# EAGLE design ControleCarga (EAGLE 9.6.2)

## Sheet 1 of 2
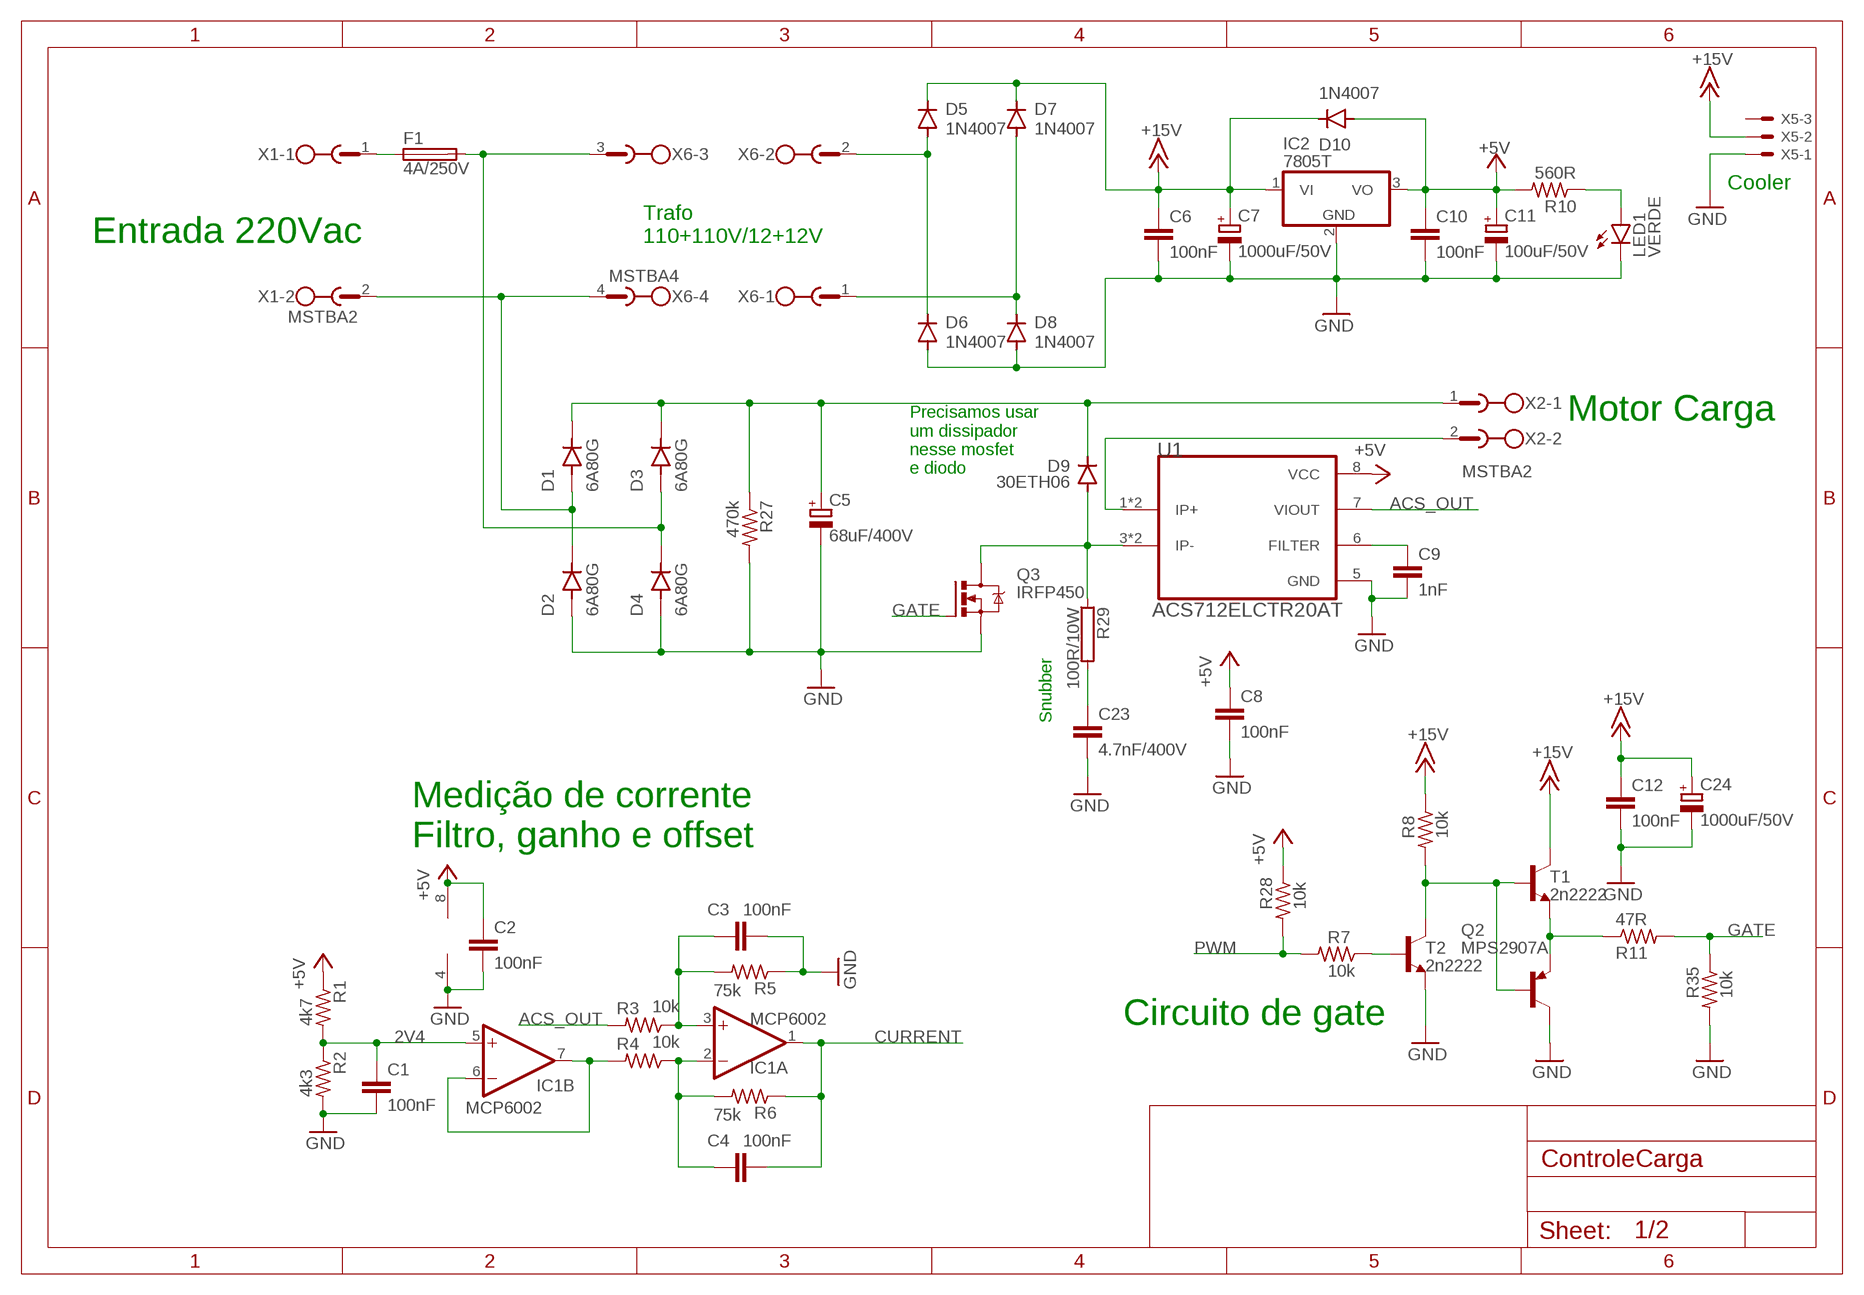
[diagram p0: schematic, sheet 1]

### Parts
C1  100nF  C-EU050-025X075  [C050-025X075]
C2  100nF  C-EU050-025X075  [C050-025X075]
C3  100nF  C-EU050-025X075  [C050-025X075]
C4  100nF  C-EU050-025X075  [C050-025X075]
C5  68uF/400V  CPOL-EUE7.5-18  [E7,5-18]
C6  100nF  C-EU050-025X075  [C050-025X075]
C7  1000uF/50V  CPOL-EUE5-13  [E5-13]
C8  100nF  C-EU050-025X075  [C050-025X075]
C9  1nF  C-EU025-024X044  [C025-024X044]
C10  100nF  C-EU050-025X075  [C050-025X075]
C11  100uF/50V  CPOL-EUE3.5-8  [E3,5-8]
C12  100nF  C-EU050-025X075  [C050-025X075]
C23  4.7nF/400V  C-EU102-043X133  [C102-043X133]
C24  1000uF/50V  CPOL-EUE5-13  [E5-13]
D1  6A80G  [DIOAD1950W125L885D700]
D2  6A80G  [DIOAD1950W125L885D700]
D3  6A80G  [DIOAD1950W125L885D700]
D4  6A80G  [DIOAD1950W125L885D700]
D5  1N4007  1N4004  [DO41-10]
D6  1N4007  1N4004  [DO41-10]
D7  1N4007  1N4004  [DO41-10]
D8  1N4007  1N4004  [DO41-10]
D9  30ETH06  BYT08P  [TO220ACS]
D10  1N4007  1N4004  [DO41-10]
F1  4A/250V  FUSESH22  [SH22]
IC1  MCP6002  MCP602SN  [SO08]
IC2  7805T  [TO220H]
LED1  VERDE  LED5MM  [LED5MM]
Q2  MPS2907A  [TO92-CBE]
Q3  IRFP450  IRFPC40  [TO247BV]
R1  4k7  R-US_0207/10  [0207/10]
R2  4k3  R-US_0207/10  [0207/10]
R3  10k  R-US_0207/10  [0207/10]
R4  10k  R-US_0207/10  [0207/10]
R5  75k  R-US_0207/10  [0207/10]
R6  75k  R-US_0207/10  [0207/10]
R7  10k  R-US_0207/10  [0207/10]
R8  10k  R-US_0207/10  [0207/10]
R10  560R  R-US_0207/10  [0207/10]
R11  47R  R-US_0207/10  [0207/10]
R27  470k  R-US_0207/10  [0207/10]
R28  10k  R-US_0207/10  [0207/10]
R29  100R/10W  RKH216-8  [KH216-8]
R35  10k  R-US_0207/10  [0207/10]
T1  2n2222  2N2222-NPN-TO92-EBC  [TO92-EBC]
T2  2n2222  2N2222-NPN-TO92-EBC  [TO92-EBC]
U1  ACS712ELCTR20AT  ACS712ELCTR30AT  [SOIC127P600X175-8N]
X1  MSTBA2  [MSTBA2]
X2  MSTBA2  [MSTBA2]
X5  KK-156-3  [KK-156-3]
X6  MSTBA4  [MSTBA4]

### Nets
2V4: C1.1 IC1.5(B:+IN) R1.2 R2.1
+5V: C2.1 C8.1 C10.1 C11.+ D10.A IC1.8(P:V+) IC2.3(VO) R1.1 R10.2 R28.1 U1.8(VCC) ; also sheet 2
+15V: C6.1 C7.+ C12.1 C24.+ D5.C D7.C D10.C IC2.1(VI) R8.1 T1.C X5.2
ACS_OUT: R3.2 U1.7(VIOUT)
CURRENT: C4.2 IC1.1(A:OUT) R6.1 ; also sheet 2
GATE: Q3.G R11.2 R35.1
GND: C1.2 C2.2 C3.2 C5.- C6.2 C7.- C8.2 C9.2 C10.2 C11.- C12.2 C23.2 C24.- D2.A D4.A D6.A D8.A IC1.4(P:V-) IC2.2(GND) LED1.K(C) Q2.C Q3.S R2.2 R5.1 R27.2 R35.2 T2.E U1.5(GND) X5.1 ; also sheet 2
N$9: D7.A D8.C X6.1
N$11: C23.1 R29.2
N$18: Q2.E R11.1 T1.E
N$19: LED1.A R10.1
N$22: D3.A D4.C(K) F1.2 X6.3
N$33: D1.A D2.C(K) X1.2 X6.4
N$34: U1.1(IP+) U1.2(IP+) X2.2
N$35: D9.A Q3.D R29.1 U1.3(IP-) U1.4(IP-)
N$37: C5.+ D1.C(K) D3.C(K) D9.C R27.1 X2.1
N$38: C9.1 U1.6(FILTER)
N$39: IC1.6(B:-IN) IC1.7(B:OUT) R4.2
N$40: C4.1 IC1.2(A:-IN) R4.1 R6.2
N$41: C3.1 IC1.3(A:+IN) R3.1 R5.2
N$42: F1.1 X1.1
N$45: R7.1 T2.B
N$46: D5.A D6.C X6.2
N$53: Q2.B R8.2 T1.B T2.C
PWM: R7.2 R28.2 ; also sheet 2
Unconnected: X5.3

### Notes on the sheet
- Cooler
- Entrada 220Vac
- Trafo
  110+110V/12+12V
- Motor Carga
- Precisamos usar
  um dissipador
  nesse mosfet
  e diodo
- Snubber
- Medição de corrente
  Filtro, ganho e offset
- Circuito de gate

## Sheet 2 of 2
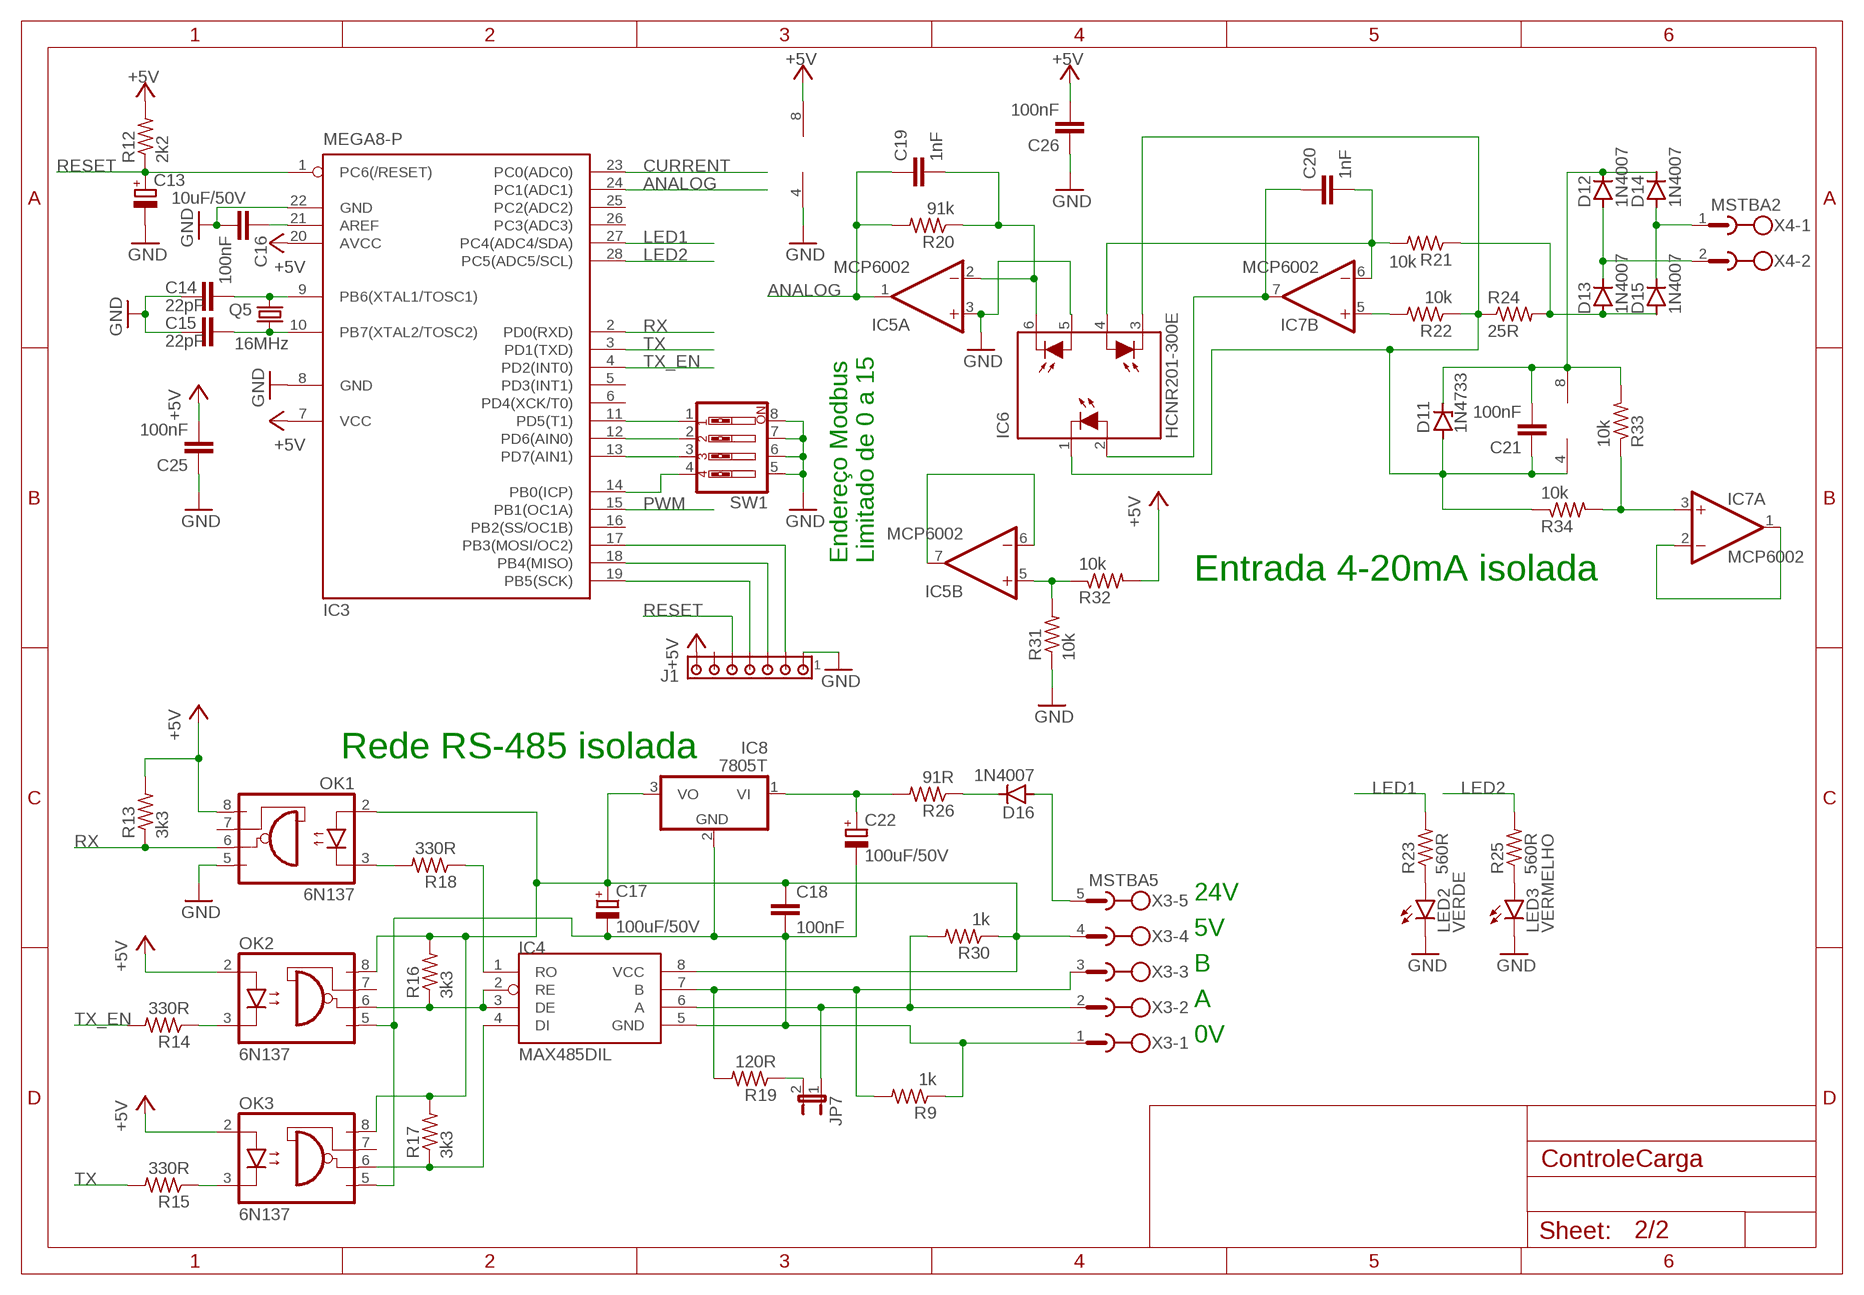
[diagram p1: schematic, sheet 2]

### Parts
C13  10uF/50V  CPOL-EUE2-5  [E2-5]
C14  22pF  C-EU025-024X044  [C025-024X044]
C15  22pF  C-EU025-024X044  [C025-024X044]
C16  100nF  C-EU050-025X075  [C050-025X075]
C17  100uF/50V  CPOL-EUE3.5-8  [E3,5-8]
C18  100nF  C-EU050-025X075  [C050-025X075]
C19  1nF  C-EU025-024X044  [C025-024X044]
C20  1nF  C-EU025-024X044  [C025-024X044]
C21  100nF  C-EU050-025X075  [C050-025X075]
C22  100uF/50V  CPOL-EUE3.5-8  [E3,5-8]
C25  100nF  C-EU050-025X075  [C050-025X075]
C26  100nF  C-EU050-025X075  [C050-025X075]
D11  1N4733  1N4728  [DO41Z10]
D12  1N4007  1N4004  [DO41-10]
D13  1N4007  1N4004  [DO41-10]
D14  1N4007  1N4004  [DO41-10]
D15  1N4007  1N4004  [DO41-10]
D16  1N4007  1N4004  [DO41-10]
IC3  MEGA8-P  [DIL28-3]
IC4  MAX485DIL  [DIL08]
IC5  MCP6002  MCP602SN  [SO08]
IC6  HCNR201-300E  [DIP8-400]
IC7  MCP6002  MCP602SN  [SO08]
IC8  7805T  [TO220H]
J1  MTA07-100  [10X07MTA]
JP7  JP1E  [JP1]
LED2  VERDE  LED5MM  [LED5MM]
LED3  VERMELHO  LED5MM  [LED5MM]
OK1  6N137  [DIL08]
OK2  6N137  [DIL08]
OK3  6N137  [DIL08]
Q5  16MHz  CRYSTALHC49S  [HC49/S]
R9  1k  R-US_0207/10  [0207/10]
R12  2k2  R-US_0207/10  [0207/10]
R13  3k3  R-US_0207/10  [0207/10]
R14  330R  R-US_0207/10  [0207/10]
R15  330R  R-US_0207/10  [0207/10]
R16  3k3  R-US_0207/10  [0207/10]
R17  3k3  R-US_0207/10  [0207/10]
R18  330R  R-US_0207/10  [0207/10]
R19  120R  R-US_0207/10  [0207/10]
R20  91k  R-US_0207/10  [0207/10]
R21  10k  R-US_0207/10  [0207/10]
R22  10k  R-US_0207/10  [0207/10]
R23  560R  R-US_0207/10  [0207/10]
R24  25R  R-US_0207/10  [0207/10]
R25  560R  R-US_0207/10  [0207/10]
R26  91R  R-US_0207/10  [0207/10]
R30  1k  R-US_0207/10  [0207/10]
R31  10k  R-US_0207/10  [0207/10]
R32  10k  R-US_0207/10  [0207/10]
R33  10k  R-US_0207/10  [0207/10]
R34  10k  R-US_0207/10  [0207/10]
SW1  SW_DIP-4  [EDG-04]
X3  MSTBA5  [MSTBA5]
X4  MSTBA2  [MSTBA2]

### Nets
0V: C17.- C18.2 C22.- IC4.5(GND) IC8.2(GND) OK2.5(GND) OK3.5(GND) R9.1 X3.1
+5V: C25.2 C26.2 IC3.7(VCC) IC3.20(AVCC) IC5.8(P:V+) J1.7 OK1.8(VCC) OK2.2(A) OK3.2(A) R12.2 R13.2 R32.2 ; also sheet 1
ANALOG: C19.1 IC3.24(PC1(ADC1)) IC5.1(A:OUT) R20.2
CURRENT: IC3.23(PC0(ADC0)) ; also sheet 1
GND: C13.- C14.2 C15.2 C16.2 C25.1 C26.1 IC3.8(GND) IC3.22(GND) IC5.3(A:+IN) IC5.4(P:V-) IC6.5(A2) J1.1 LED2.K(C) LED3.K(C) OK1.5(GND) R31.1 SW1.5 SW1.6 SW1.7 SW1.8 ; also sheet 1
GNDISO: C21.1 D11.A IC6.1(C) IC6.3(C1) IC7.4(P:V-) R22.1 R24.1 R34.1
LED1: IC3.27(PC4(ADC4/SDA)) R23.2
LED2: IC3.28(PC5(ADC5/SCL)) R25.2
N$1: C16.1 IC3.21(AREF)
N$2: IC4.2(RE) IC4.3(DE) OK2.6(VO) R16.1
N$3: D14.A D15.C X4.1
N$4: LED2.A R23.1
N$5: IC3.14(PB0(ICP)) SW1.4
N$6: IC3.13(PD7(AIN1)) SW1.3
N$7: IC3.12(PD6(AIN0)) SW1.2
N$8: IC3.11(PD5(T1)) SW1.1
N$10: LED3.A R25.1
N$12: C21.2 D11.C D12.C D14.C IC7.8(P:V+) R33.2
N$13: IC4.7(B) R9.2 R19.2 X3.3
N$14: IC4.6(A) JP7.1 R30.2 X3.2
N$15: IC4.4(DI) OK3.6(VO) R17.1
N$16: OK1.3(C) R18.2
N$17: IC4.1(RO) R18.1
N$20: OK2.3(C) R14.1
N$21: OK3.3(C) R15.1
N$23: IC3.19(PB5(SCK)) J1.4
N$24: JP7.2 R19.1
N$25: C19.2 IC5.2(A:-IN) IC6.6(C2) R20.1
N$26: C22.+ IC8.1(VI) R26.2
N$27: IC5.6(B:-IN) IC5.7(B:OUT)
N$28: IC7.1(A:OUT) IC7.2(A:-IN)
N$29: C20.1 IC6.2(A) IC7.7(B:OUT)
N$30: IC7.5(B:+IN) R22.2
N$31: D13.A D15.A R21.1 R24.2
N$32: C20.2 IC6.4(A1) IC7.6(B:-IN) R21.2
N$36: IC3.18(PB4(MISO)) J1.3
N$43: C17.+ C18.1 IC4.8(VCC) IC8.3(VO) OK1.2(A) OK2.8(VCC) OK3.8(VCC) R16.2 R17.2 R30.1 X3.4
N$44: IC3.17(PB3(MOSI/OC2)) J1.2
N$47: D16.A X3.5
N$48: D12.A D13.C X4.2
N$49: C14.1 IC3.9(PB6(XTAL1/TOSC1)) Q5.2
N$50: C15.1 IC3.10(PB7(XTAL2/TOSC2)) Q5.1
N$51: D16.C R26.1
N$52: IC5.5(B:+IN) R31.2 R32.1
N$54: IC7.3(A:+IN) R33.1 R34.2
PWM: IC3.15(PB1(OC1A)) ; also sheet 1
RESET: C13.+ IC3.1(PC6(/RESET)) J1.5 R12.1
RX: IC3.2(PD0(RXD)) OK1.6(VO) R13.1
TX: IC3.3(PD1(TXD)) R15.2
TX_EN: IC3.4(PD2(INT0)) R14.2
Unconnected: IC3.5(PD3(INT1)) IC3.6(PD4(XCK/T0)) IC3.16(PB2(SS/OC1B)) IC3.25(PC2(ADC2)) IC3.26(PC3(ADC3)) J1.6 OK1.7(VE) OK2.7(VE) OK3.7(VE)

### Notes on the sheet
- Endereço Modbus
  Limitado de 0 a 15
- Entrada 4-20mA isolada
- Rede RS-485 isolada
- 24V
- 5V
- B
- A
- 0V

## Library data of the parts
C1-C4 C6 C8-C10 C12 C14-C16 C18-C21 C23 C25 C26 = rcl:C-EU: CAPACITOR, European symbol; SPICEPREFIX: C
C5 C7 C11 C13 C17 C22 C24 = rcl:CPOL-EU: POLARIZED CAPACITOR, European symbol; SPICEPREFIX: C
D1-D4 = 6A80G:6A80G: Check availability <https://pricing.snapeda.com/parts/6A80G/Taiwan%20Semiconductor/view-part?ref=eda>; AVAILABILITY: In Stock; DESCRIPTION: 6A, 800V, Standard Recovery Rectifier; MF: Taiwan Semiconductor; MP: 6A80G; PACKAGE: R-6 Taiwan Semiconductor; PRICE: None; PURCHASE-URL: https://pricing.snapeda.com/search/part/6A80G/?ref=eda
D5-D8 D10 D12-D16 = diode:1N4004: DIODE general purpose rectifier, 1 A
D9 = diode:BYT08P: DIODE ultra fast
D11 = diode:1N4728: Z DIODE 3.3 V, 1W, 5 percent
F1 = fuse:FUSE: Fuse; OC_FARNELL: unknown; OC_NEWARK: unknown
IC1 IC5 IC7 = linear:MCP602: Single Op Amp 2.7V to 6.0V Single Supply CMOS Source: http://ww1.microchip.com/downloads/en/DeviceDoc/21314g.pdf
IC2 IC8 = linear:78*: Positive VOLTAGE REGULATOR Source: http://cache.national.com/ds/LM/LM78L05.pdf http://www.fairchildsemi.com/ds/LM/LM7805.pdf
IC3 = atmel:MEGA8-P: MICROCONTROLLER 8 Kbytes FLASH, 1 kbytes SRAM, 512 bytes EEPROM, USART, 4-channel 10 bit ADC, 2-channel 8 bit ADC Pin compatible with Atmega48, ATMega88, ATMega168 Source: avr.lbr; OC_FARNELL: unknown; OC_NEWARK: unknown
IC4 = MAX485:MAX485; DESCRIPTION: 1/1 Transceiver Half RS422, RS485 8-uMAX-EP|8-uSOP-EP; MF: Maxim Integrated; MP: MAX485; PACKAGE: None; PURCHASE-URL: https://pricing.snapeda.com/search/part/MAX485/?ref=eda
IC6 = avago:HCNR20*: High-Linearity Analog Optocouplers Source: AV02-0886EN+DS+HCNR200+10Dec2011.pdf
J1 = con-amp:MTA07-100: AMP connector
JP7 = jumper:JP1E: JUMPER
LED1-LED3 = led:LED: LED OSRAM: - CHIPLED LG R971, LG N971, LY N971, LG Q971, LY Q971, LO R971, LY R971 LH N974, LH R974 LS Q976, LO Q976, LY Q976 LO Q996 - Hyper CHIPLED LW Q18S LB Q993, LB Q99A, LB R99A - SideLED LS A670, LO A670, LY A670, LG A670, LP A670 LB A673, LV A673, LT A673, LW A673 LH A674 LY A675 LS A676, LA A676, LO A676, LY A676, LW A676 LS A679, LY A679, LG A679 - Hyper Micro SIDELED® LS Y876, LA Y876, LO Y876, LY Y876 LT Y87S - SmartLED LW L88C, LW L88S LB L89C, LB L89S, LG L890 LS L89K, LO L89K, LY L89K LS L896, LA L896, LO L896, LY L896 - TOPLED LS T670, LO T670, LY T670, LG T670, LP T670 LSG T670, LSP T670, LSY T670, LOP T670, LYG T670 LG T671, LOG T671, LSG T671 LB T673, LV T673, LT T673, LW T673 LH T674 LS T676, LA T676, LO T676, LY T676, LB T676, LH T676, LSB T676, LW T676 LB T67C, LV T67C, LT T67C, LS T67K, LO T67K, LY T67K, LW E67C LS E67B, LA E67B, LO E67B, LY E67B, LB E67C, LV E67C, LT E67C LW T67C LS T679, LY T679, LG T679 LS T770, LO T770, LY T770, LG T770, LP T770 LB T773, LV T773, LT T773, LW T773 LH T774 LS E675, LA E675, LY E675, LS T675 LS T776, LA T776, LO T776, LY T776, LB T776 LHGB T686 LT T68C, LB T68C - Hyper Mini TOPLED® LB M676 - Mini TOPLED Santana® LG M470 LS M47K, LO M47K, LY M47K Source: http://www.osram.convergy.de LUXEON: - LUMILED® LXK2-PW12-R00, LXK2-PW12-S00, LXK2-PW14-U00, LXK2-PW14-V00 LXK2-PM12-R00, LXK2-PM12-S00, LXK2-PM14-U00 LXK2-PE12-Q00, LXK2-PE12-R00, LXK2-PE12-S00, LXK2-PE14-T00, LXK2-PE14-U00 LXK2-PB12-K00, LXK2-PB12-L00, LXK2-PB12-M00, LXK2-PB14-N00, LXK2-PB14-P00, LXK2-PB14-Q00 LXK2-PR12-L00, LXK2-PR12-M00, LXK2-PR14-Q00, LXK2-PR14-R00 LXK2-PD12-Q00, LXK2-PD12-R00, LXK2-PD12-S00 LXK2-PH12-R00, LXK2-PH12-S00 LXK2-PL12-P00, LXK2-PL12-Q00, LXK2-PL12-R00 Source: www.luxeon.com KINGBRIGHT: KA-3528ASYC Source: www.kingbright.com
OK1-OK3 = optocoupler:6N137: MOTOROLA OPTO COUPLER; MPN: 6N137; OC_FARNELL: 1328376; OC_NEWARK: 52M1895
Q2 = transistor-pnp:MPS2907*: PNP Transistror
Q3 = transistor-power:IRFPC40: N-CHANNEL MOS FET
Q5 = crystal:CRYSTAL: CRYSTAL; OC_FARNELL: 1667008; OC_NEWARK: unknown
R1-R28 R30-R35 = rcl:R-US_: RESISTOR, American symbol; SPICEPREFIX: R
R29 = resistor-power:R: Power Resitor; OC_FARNELL: unknown; OC_NEWARK: unknown
SW1 = special:SW_DIP-4: DIP SWITCH
T1 T2 = transistor-neu-to92:*-NPN-: NPN Transistror
U1 = ACS712ELCTR30AT:ACS712ELCTR30AT: Sensor: current; Package: SO8; Usup: 4.5÷5.5VDC; Iin: ± 30A; 66mV Check availability <https://pricing.snapeda.com/parts/ACS712ELCTR-30A-T/Allegro/view-part?ref=eda>; AVAILABILITY: In Stock; DESCRIPTION: Current Sensor 30A 1 Channel Hall Effect, Open Loop Bidirectional 8-SOIC (0.154, 3.90mm Width); MF: Allegro; MP: ACS712ELCTR-30A-T; PACKAGE: SOIC-8 Allegro MicroSystems LLC; PRICE: None; PURCHASE-URL: https://pricing.snapeda.com/search/part/ACS712ELCTR-30A-T/?ref=eda
X1 X2 X4 = con-phoenix-508:MSTBA2: PHOENIX; MF: FARNELL; MPN: 1757242; OC_FARNELL: 3705171; OC_NEWARK: 71C4161
X3 = con-phoenix-508:MSTBA5: PHOENIX; MPN: 1757271; OC_FARNELL: 3705201; OC_NEWARK: 71C4164
X5 = con-molex:KK-156-3: KK 156 HEADER Source: http://www.molex.com/pdm_docs/sd/026604100_sd.pdf; MF: MOLEX; OC_FARNELL: unknown; OC_NEWARK: unknown
X6 = con-phoenix-508:MSTBA4: PHOENIX; MF: FARNELL; MPN: 1757268; OC_FARNELL: 3705195; OC_NEWARK: 71C4163

## Board
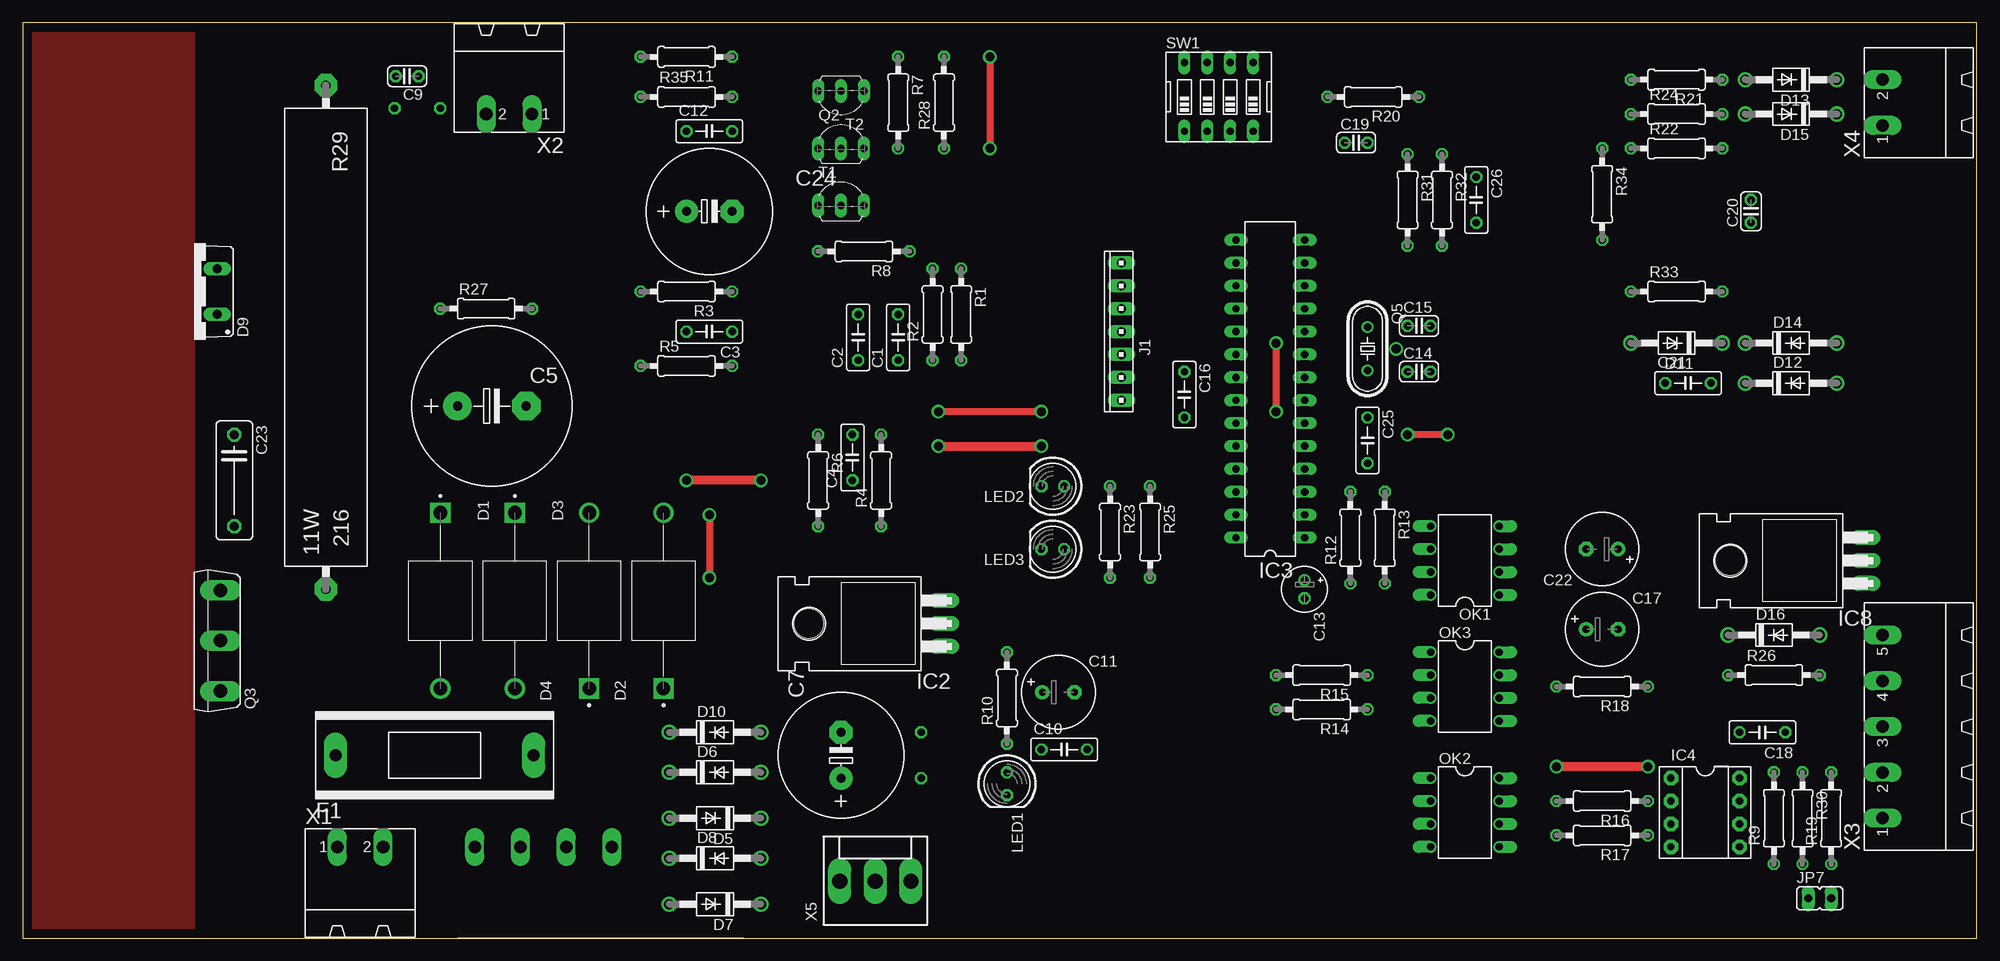
[diagram p2: board, top side]
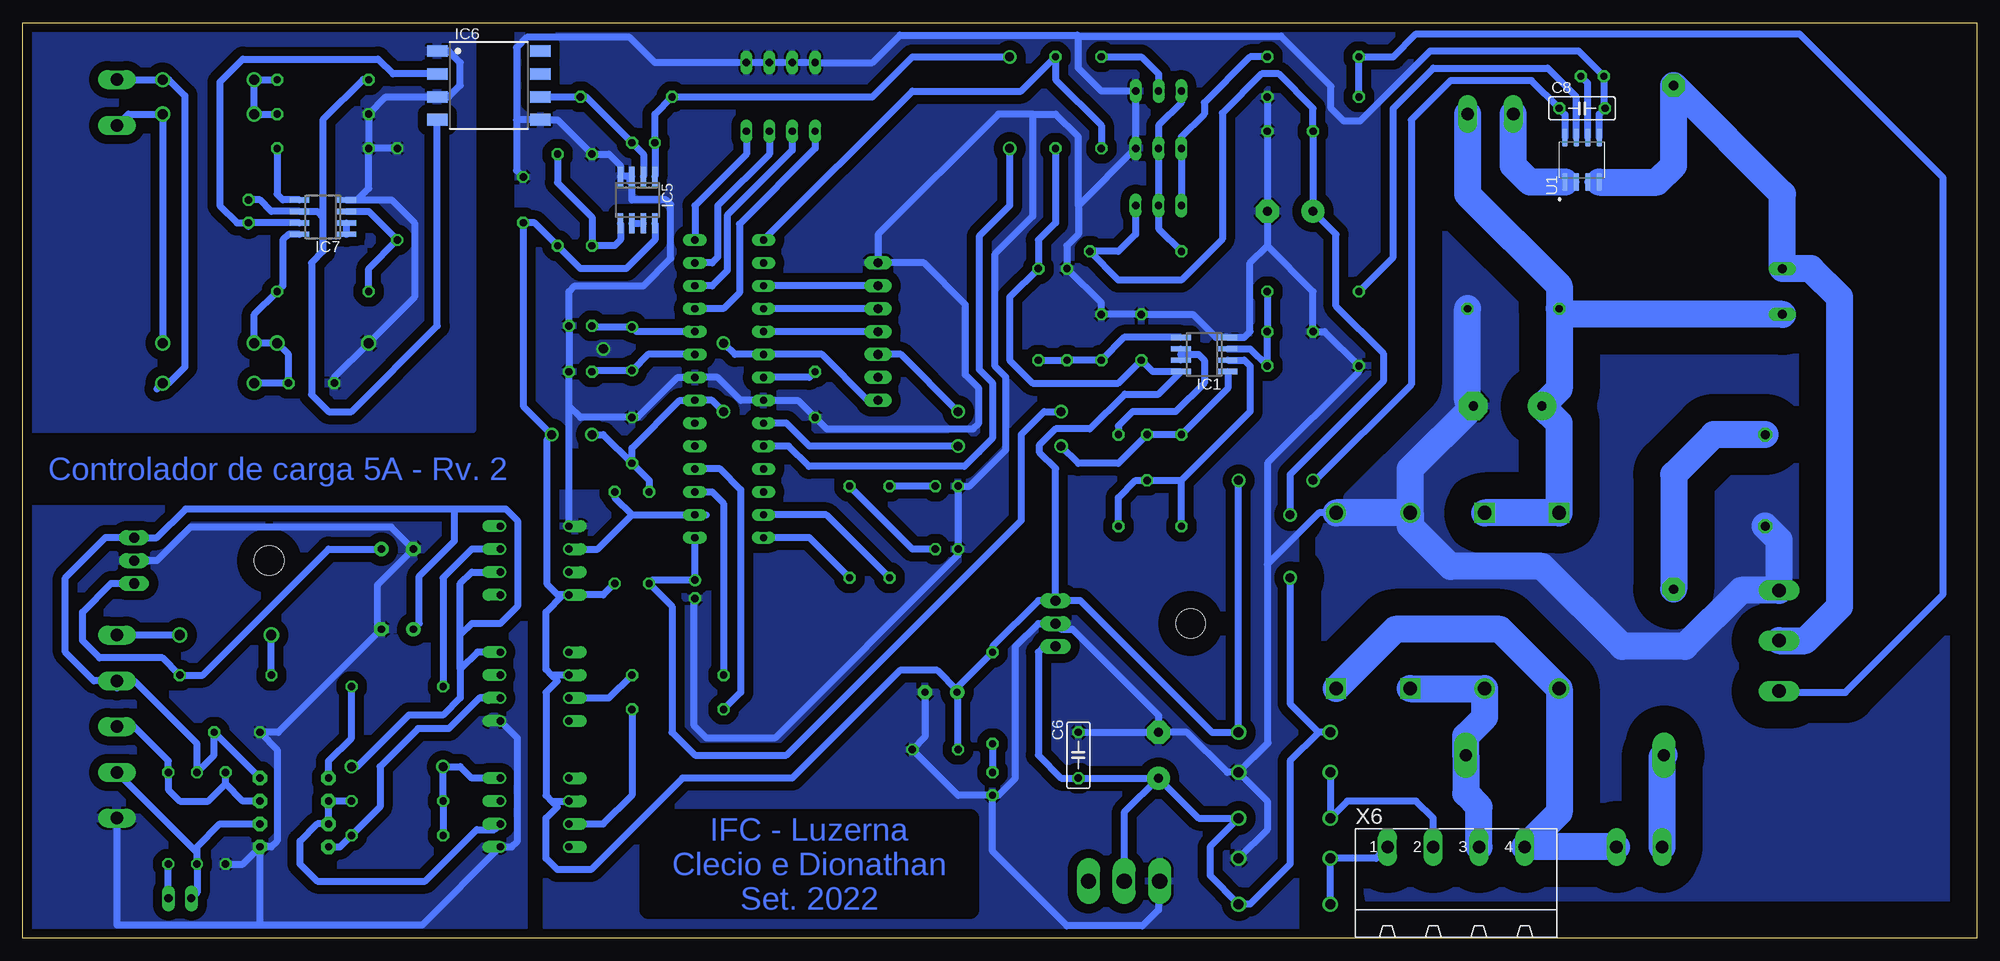
[diagram p3: board, bottom side, seen from below]

Size 216.84 x 101.59 mm. Coordinates in mm from the lower left corner, seen from the top.
Outline: 0,0 216.84,0 216.84,101.59 0,101.59 0,0
Copper layers (1*16): Top 0.035mm / dielectric 1.5mm / Bottom 0.035mm
Design rules "default *": minimum track width 0.75mm, minimum drill 0.5mm, track to track 0.75mm, track to pad 0.5mm, pad to pad 0.5mm, via to via 0.5mm, smd to smd 0.3mm, copper to edge 40mil, drill to drill 6mil, minimum pad ring 10mil, minimum via ring 8mil, stop-mask expansion 4mil, vias tented up to drill 0mil, thermal gap 10mil

### Footprints (pad centres in the part's own frame; a part is rotated, then mirrored left to right if it is on the bottom)
C050-025X075 = drill 0.813 octagon: 1 -2.54,0; 2 2.54,0
E7,5-18 = drill 1.016 pad 3.15: + -3.81,0 | drill 1.016 pad 3.15 octagon: - 3.81,0
E5-13 = drill 1.016 pad 2.54: + -2.54,0 | drill 1.016 pad 2.54 octagon: - 2.54,0
C025-024X044 = drill 0.813 octagon: 1 -1.27,0; 2 1.27,0
E3,5-8 = drill 0.813 pad 1.6: + -1.778,0 | drill 0.813 pad 1.6 octagon: - 1.778,0
E2-5 = drill 0.813 pad 1.27: + -1.016,0 | drill 0.813 pad 1.27 octagon: - 1.016,0
C102-043X133 = drill 1.016 octagon: 1 -5.08,0; 2 5.08,0
DIOAD1950W125L885D700 = drill 1.5: A 9.75,0 | drill 1.5 square: C -9.75,0
DO41-10 = drill 1.118: A 5.08,0; C -5.08,0
TO220ACS = drill 1.016 long: A 2.54,-2.54; C -2.54,-2.54
DO41Z10 = drill 1.118: A 5.08,0; C -5.08,0
SH22 = drill 1.321 pad 2.54 long: 1 -10.998,0; 2 10.998,0
SO08 = smd 0.6 x 2.2: 1 -1.905,-2.6; 2 -0.635,-2.6; 3 0.635,-2.6; 4 1.905,-2.6; 5 1.905,2.6; 6 0.635,2.6; 7 -0.635,2.6; 8 -1.905,2.6
TO220H = drill 1.118 long: 1 -2.54,-10.16; 2 0,-10.16; 3 2.54,-10.16 | hole 3.302: 0,4.826
DIL28-3 = drill 0.813 long: 1 -16.51,-3.81; 2 -13.97,-3.81; 3 -11.43,-3.81; 4 -8.89,-3.81; 5 -6.35,-3.81; 6 -3.81,-3.81; 7 -1.27,-3.81; 8 1.27,-3.81; 9 3.81,-3.81; 10 6.35,-3.81; 11 8.89,-3.81; 12 11.43,-3.81; 13 13.97,-3.81; 14 16.51,-3.81; 15 16.51,3.81; 16 13.97,3.81; 17 11.43,3.81; 18 8.89,3.81; 19 6.35,3.81; 20 3.81,3.81; 21 1.27,3.81; 22 -1.27,3.81; 23 -3.81,3.81; 24 -6.35,3.81; 25 -8.89,3.81; 26 -11.43,3.81; 27 -13.97,3.81; 28 -16.51,3.81
DIL08 = drill 0.813 pad 1.6 octagon: 1 -3.81,-3.81; 2 -1.27,-3.81; 3 1.27,-3.81; 4 3.81,-3.81; 5 3.81,3.81; 6 1.27,3.81; 7 -1.27,3.81; 8 -3.81,3.81
DIP8-400 = smd 1.3 x 2.29: 1 -3.81,-5.72; 2 -1.27,-5.72; 3 1.27,-5.72; 4 3.81,-5.72; 5 3.81,5.72; 6 1.27,5.72; 7 -1.27,5.72; 8 -3.81,5.72
10X07MTA = drill 1.016 long: 1 7.62,0; 2 5.08,0; 3 2.54,0; 4 0,0; 5 -2.54,0; 6 -5.08,0; 7 -7.62,0
JP1 = drill 0.914 long: 1 0,-1.27; 2 0,1.27
LED5MM = drill 0.813 octagon: A -1.27,0; K 1.27,0
DIL08' = drill 0.813 offset: 1 -3.81,-3.81; 2 -1.27,-3.81; 3 1.27,-3.81; 4 3.81,-3.81; 5 3.81,3.81; 6 1.27,3.81; 7 -1.27,3.81; 8 -3.81,3.81
TO92-CBE = drill 0.813 long: B 0,0; C 2.54,0; E -2.54,0
TO247BV = drill 1.499 long: D 0,-2.921; G -5.588,-2.921; S 5.588,-2.921
HC49/S = drill 0.813: 1 -2.413,0; 2 2.413,0
0207/10 = drill 0.813 octagon: 1 -5.08,0; 2 5.08,0
KH216-8 = drill 1.016 pad 2.54 octagon: 1 -27.94,0; 2 27.94,0
EDG-04 = drill 0.813 long: 1 -3.81,-3.81; 2 -1.27,-3.81; 3 1.27,-3.81; 4 3.81,-3.81; 5 3.81,3.81; 6 1.27,3.81; 7 -1.27,3.81; 8 -3.81,3.81
TO92-EBC = drill 0.813 long: B 0,-1.27; C 2.54,-1.27; E -2.54,-1.27
SOIC127P600X175-8N = smd 1.97 x 0.6: 1 -2.475,1.905; 2 -2.475,0.635; 3 -2.475,-0.635; 4 -2.475,-1.905; 5 2.475,-1.905; 6 2.475,-0.635; 7 2.475,0.635; 8 2.475,1.905
MSTBA2 = drill 1.397 long: 1 -2.54,5.08; 2 2.54,5.08
MSTBA5 = drill 1.397 long: 1 -10.16,5.08; 2 -5.08,5.08; 3 0,5.08; 4 5.08,5.08; 5 10.16,5.08
KK-156-3 = drill 1.7 pad 2.184 long: 1 -3.96,0; 2 0,0; 3 3.96,0
MSTBA4 = drill 1.397 long: 1 -7.62,5.08; 2 -2.54,5.08; 3 2.54,5.08; 4 7.62,5.08

### Placement (x,y rotation side)
C1  97.16,66.67 90 top
C2  92.71,66.67 90 top
C3  76.2,67.31 180 top
C4  92.08,53.34 90 top
C5  52.07,59.05 0 top
C6  99.69,20.32 90 bottom
C7  90.81,20.32 90 top
C8  43.81,92.08 0 bottom
C9  42.67,95.63 180 top
C10  115.57,20.95 0 top
C11  114.94,27.3 0 top
C12  76.2,89.53 0 top
C13  142.24,38.73 270 top
C14  154.94,62.87 0 top
C15  154.94,67.94 0 top
C16  128.91,60.33 270 top
C17  175.26,34.29 0 top
C18  193.04,22.86 180 top
C19  147.96,88.27 0 top
C20  191.77,80.64 90 top
C21  184.78,61.59 0 top
C22  175.26,43.18 180 top
C23  23.5,50.8 270 top
C24  76.2,80.64 0 top
C25  149.22,55.24 270 top
C26  161.29,81.92 270 top
D1  46.35,37.47 270 top
D2  71.12,37.47 90 top
D3  54.61,37.47 270 top
D4  62.87,37.47 90 top
D5  76.83,13.34 180 top
D6  76.83,18.41 0 top
D7  76.83,3.81 180 top
D8  76.83,8.89 0 top
D9  19.05,71.75 90 top
D10  76.83,22.86 0 top
D11  183.51,66.04 180 top
D12  196.22,61.59 0 top
D13  196.22,95.25 180 top
D14  196.22,66.04 0 top
D15  196.22,91.44 180 top
D16  194.31,33.66 0 top
F1  45.72,20.32 0 top
IC1  85.72,64.77 90 bottom
IC2  92.08,34.92 90 top
IC3  138.43,60.96 90 top
IC4  186.69,13.97 270 top
IC5  148.59,81.92 180 bottom
IC6  165.1,94.61 270 bottom
IC7  183.51,80.01 90 bottom
IC8  194.31,41.91 90 top
J1  121.92,67.31 90 top
JP7  199.39,4.45 270 top
LED1  109.22,17.14 270 top
LED2  114.3,50.16 180 top
LED3  114.3,43.18 180 top
OK1  6N137  [DIL08']  160.02,41.91 90 top
OK2  6N137  [DIL08']  160.02,13.97 270 top
OK3  6N137  [DIL08']  160.02,27.94 270 top
Q2  90.81,87.63 0 top
Q3  19.05,33.02 90 top
Q5  149.22,65.41 270 top
R1  104.14,69.22 270 top
R2  100.97,69.22 90 top
R3  73.66,71.75 180 top
R4  95.25,50.8 90 top
R5  73.66,63.5 0 top
R6  88.27,50.8 270 top
R7  97.16,92.71 270 top
R8  93.34,76.2 180 top
R9  194.31,13.34 90 top
R10  109.22,26.67 90 top
R11  73.66,97.79 180 top
R12  147.32,44.45 90 top
R13  151.13,44.45 270 top
R14  144.15,25.4 180 top
R15  144.15,29.21 180 top
R16  175.26,15.24 180 top
R17  175.26,11.43 180 top
R18  175.26,27.94 180 top
R19  200.66,13.34 90 top
R20  149.86,93.34 180 top
R21  183.51,95.25 180 top
R22  183.51,87.63 0 top
R23  120.65,45.09 270 top
R24  183.51,91.44 0 top
R25  125.09,45.09 270 top
R26  194.31,29.21 0 top
R27  51.44,69.85 0 top
R28  102.23,92.71 90 top
R29  33.66,66.67 270 top
R30  197.49,13.34 270 top
R31  153.67,81.92 270 top
R32  157.48,81.92 270 top
R33  183.51,71.75 0 top
R34  175.26,82.55 270 top
R35  73.66,93.34 0 top
SW1  132.72,93.34 0 top
T1  90.81,82.55 0 top
T2  90.81,92.71 180 top
U1  43.81,86.36 90 bottom
X1  37.47,5.08 0 top
X2  53.98,96.52 180 top
X3  211.46,23.5 90 top
X4  211.46,92.71 90 top
X5  94.61,6.35 0 top
X6  57.78,5.08 0 bottom

### Tracks (layer width: path | path; a pad name or v marks a point on that pad's centre or on a via)
0V
  Bottom 0.75: X3.1 206.38,1.52 190.25,1.52 | 190.25,1.52 190.5,1.76 IC4.5 | IC4.5 189.23,10.16 188.59,10.79 188.59,20.95 C18.2 188.47,22.86 C17.- 177.48,34.2 177.48,39.18 C22.- 175.93,45.62 198.22,45.62 201.93,41.91 IC8.2 | 190.25,1.52 172.47,1.52 OK2.5 162.56,10.16 161.93,10.79 161.93,22.23 OK3.5 | R9.1 192.41,8.26 IC4.5
  pour Bottom (isolate 1.016): 161.29,47.62 161.29,1.27 215.9,1.27 215.9,47.62
2V4
  Bottom 0.75: R1.2 R2.1 C1.1 94.61,66.67 IC1.5
+5V  (via drill 1)
  Top 0.75: v158.12,55.88 v153.67,55.88 | v139.06,66.04 v139.06,58.42
  Top 1: v81.92,50.8 v73.66,50.8
  Bottom 0.75: U1.8 45.72,91.38 46.35,92.01 C8.1 49.44,95.16 58.42,95.16 62.77,90.81 62.77,61.42 73.39,50.8 v73.66,50.8 | v81.92,50.8 D10.A 84.87,22.86 99.51,37.49 102.21,37.49 IC2.3 | R28.1 102.23,79.38 104.14,77.47 R1.1 107.31,71.12 107.31,64.14 104.78,61.59 95.25,61.59 C2.1 91.44,62.87 IC1.8 90.81,60.38 94.56,60.38 98.42,56.52 102.23,56.52 103.98,54.77 103.98,53.88 102.2,52.1 102.23,52.07 IC2.3 | IC2.3 104.14,37.47 109.22,32.38 R10.2 113.16,27.81 C11.+ | C25.2 149.22,54.39 143.93,59.69 IC3.7 140.34,59.69 v139.06,58.42 | J1.7 121.94,59.71 123.07,59.71 128.13,64.77 IC3.20 137.79,64.77 v139.06,66.04 | R12.2 147.32,50.8 C25.2 | IC5.8 146.69,77.47 149.86,74.3 154.94,74.3 R32.2 160.02,79.38 C26.2 161.29,59.05 v158.12,55.88 158.63,55.37 158.63,39.27 157.46,38.1 OK1.8 | v153.67,55.88 152.4,55.88 C25.2 | 158.12,15.24 158.75,15.88 158.75,27.3 157.48,28.57 158.12,29.21 | 158.12,15.24 157.48,14.61 158.75,13.34 158.75,8.89 157.48,7.62 153.78,7.62 143.62,17.78 131.44,17.78 119.5,29.72 115.34,29.72 113.16,27.54 C11.+ | 158.12,15.24 OK2.2 | OK3.2 158.12,29.21 | 158.12,29.21 158.75,29.84 158.75,36.2 156.84,38.1 OK1.8 | R13.2 152.4,38.1 OK1.8 | C10.1 113.03,27.18 C11.+
+15V  (via drill 1)
  Top 0.75: v76.2,46.99 v76.2,40.01
  Bottom 0.75: C7.+ C6.1 101.6,17.78 104.14,20.32 104.14,31.75 103.5,32.38 IC2.1 | C7.+ 90.17,17.14 | T1.C 93.34,78.11 95.25,76.2 R8.1 95.25,73.03 88.27,73.03 83.72,77.56 83.72,91.53 79.38,95.89 77.47,95.89 73.66,92.08 C12.1 C24.+ 71.12,78.11 71.12,70.14 65.86,64.88 65.86,61.79 76.2,51.46 v76.2,46.99 | v76.2,40.01 76.2,26.04 73.05,22.88 73.05,22.86 D10.C 73.03,22.86 76.2,19.68 76.2,8.26 80.64,3.81 D7.C 85.09,6.99 85.09,10.16 D5.C 86.36,13.34 C7.+ | C7.+ 94.61,13.97 X5.2
ACS_OUT
  Bottom 0.75: U1.7 44.45,93.34 47.62,96.52 60.33,96.52 64.77,92.08 64.77,75.56 R3.2
ANALOG  (via drill 1)
  Top 0.75: v107.31,97.79 v107.31,87.63
  Bottom 0.75: IC5.1 C19.1 146.69,91.44 R20.2 122.56,93.34 118.11,97.79 v107.31,97.79 | v107.31,87.63 107.31,81.28 110.72,77.88 110.72,63.12 109.24,61.64 109.24,55.47 110.73,53.98 | 110.73,53.98 112.36,52.35 129.58,52.35 131.84,54.61 IC3.24 | 110.72,53.96 110.73,53.98
CURRENT  (via drill 1)
  Top 1: v101.6,54.61 v113.03,54.61
  Bottom 0.75: IC1.1 83.12,61.02 R6.1 C4.2 95.25,52.7 99.69,52.7 v101.6,54.61 | v113.03,54.61 129.54,54.61 132.08,57.15 IC3.23
DISSIPADOR
  pour Top: 0,0 19.05,0 19.05,101.6 0,101.6
GATE
  Bottom 0.75: R35.1 R11.2 64.77,97.79 62.23,100.33 19.68,100.33 3.81,84.45 3.81,38.1 14.61,27.3 21.84,27.3 Q3.G
GND  (via drill 1)
  Bottom 0.75: D6.A 78.74,15.24 78.74,12.06 D8.A | C6.2 C7.- | D6.A 78.64,21.68 78.64,52.8 68.58,62.87 R5.1 72.39,67.31 C3.2 73.66,71.75 78.74,76.83 | C24.- 78.74,76.83 | 78.74,76.83 80.64,74.93 80.64,67.31 81.28,66.67 IC1.4 84.45,66.67 87,69.22 C2.2 C1.2 97.16,70.48 R2.2 100.97,76.83 99.69,78.11 99.69,81.28 | 79.38,81.28 C24.- | R35.2 C12.2 C24.- | 99.69,100.07 99.69,96.52 97.16,93.98 T2.E Q2.C 99.69,81.28 | 27.3,37.47 26.16,38.61 | 99.69,100.07 77.21,100.07 71.66,94.52 71.66,92.08 70.25,90.66 68.44,90.66 60.67,98.42 44.2,98.42 C9.2 41.4,92.2 C8.2 41.91,91.44 U1.5 | IC2.2 103.79,34.92 | C14.2 C15.2 156.21,71.75 155.57,72.39 147.96,72.39 144.93,75.42 144.93,81.43 145.41,81.92 149.22,81.92 149.22,83.66 149.46,83.89 149.46,84.52 | C14.2 156.21,59.05 154.94,57.78 C25.1 148.59,57.78 144.15,62.23 IC3.8 139.7,62.23 137.16,59.69 IC3.22 130.81,59.69 C16.2 | IC2.2 104.14,34.92 106.68,32.38 106.68,17.78 108.58,15.88 LED1.K | 99.69,100.07 99.82,100.2 119.51,100.2 122.56,97.16 SW1.8 SW1.7 SW1.6 SW1.5 146.69,97.16 149.48,99.95 160.89,99.95 162.03,98.8 162.03,90.81 | 104.78,91.44 102.23,91.44 99.69,88.9 99.69,81.28 | C13.- 142.32,37.64 142.32,23.58 140.97,22.23 133.35,22.23 113.03,42.55 LED3.K LED2.K 111.76,50.16 107.74,54.18 107.74,62.26 108.94,63.46 108.94,75.92 104.78,80.08 104.78,91.44 | 128.8,57.68 C16.2 | IC5.3 149.46,84.52 | 149.46,84.52 IC5.4 150.5,85.72 151.76,87 R31.1 157.48,90.81 IC6.5 162.03,90.81 | 162.03,90.81 162.03,85.2 C26.1 | OK1.5 C14.2 | C16.2 127.64,56.52 111.38,56.52 110.74,57.15 110.74,61.02 112.22,62.5 112.22,70.31 116.84,74.93 J1.1 121.92,78.11 108.58,91.44 104.78,91.44
  Bottom 0.75: D2.A 73.03,47.22 78.74,41.5 78.74,21.59 D6.A | D6.A 83.19,18.41 87.63,22.86 C7.- | C11.- 116.71,22.35 C10.2 113.03,15.88 LED1.K | IC2.2 101.63,34.32 100.38,34.32 90.81,24.75 C7.- | X5.1 90.81,6.2 90.81,3.17 92.59,1.39 100.97,1.39 109.22,9.65 LED1.K
  Bottom 3: D4.A D2.A | D4.A 62.87,45.72 58.42,41.27 48.26,41.27 39.37,32.38 32.38,32.38 26.16,38.61 Q3.S 21.97,44.2 C23.2 | D4.A 62.87,52.07 C5.- 56.52,59.69 R27.2
  other vias: 152.4,65.41
  pour Bottom (isolate 1.016): 161.93,101.6 161.93,52.07 158.75,48.9 158.75,0 75.56,0 75.56,48.9 62.87,61.59 62.87,101.6
  pour Bottom (isolate 3): 73.03,4.45 73.03,47.62 60.33,60.33 60.33,102.23 0,102.23 0,4.45
GNDISO
  Bottom 0.75: R24.1 178.44,90.75 | C21.1 182.25,62.23 D11.A | R24.1 R22.1 | D11.A 178.38,66.1 | R34.1 R22.1 | 179.71,81.92 175.9,81.92 173.35,79.38 173.35,71.12 D11.A | R24.1 176.53,93.34 IC6.3 169.54,93.34 168.28,94.61 168.28,97.16 169.54,98.42 IC6.1 | IC7.4 179.71,81.92 | 179.71,81.92 178.44,83.19 R22.1
  pour Bottom (isolate 1.016): 167,100.97 167,56.52 216.53,56.52 216.53,100.97
LED1
  Bottom 0.75: IC3.27 127.66,46.99 120.67,40.01 R23.2
LED2
  Bottom 0.75: IC3.28 129.54,44.45 R25.2
N$1
  Bottom 0.75: C16.1 129.54,62.23 IC3.21
N$2
  Bottom 0.75: R16.1 IC4.2 IC4.3 184.15,12.7 186.06,10.79 186.06,8.26 184.15,6.35 172.15,6.35 166.43,12.07 164.46,12.07 OK2.6
N$3
  Bottom 0.75: D14.A D15.C 205.1,91.44 X4.1
N$4
  Bottom 0.75: LED2.A R23.1
N$5
  Bottom 0.75: SW1.4 136.53,87 142.24,81.28 IC3.14
N$6
  Bottom 0.75: SW1.3 133.99,87 139.7,81.28 139.7,75.56 140.34,74.93 IC3.13
N$7
  Bottom 0.75: IC3.12 140.34,72.39 138.65,74.08 138.65,80.21 131.44,87.42 SW1.2
N$8
  Bottom 0.75: SW1.1 128.91,87.63 137.31,79.23 137.31,71.61 139.06,69.85 IC3.11
N$9
  Bottom 0.75: X6.1 66.67,8.89 D8.C D7.A
N$10
  Bottom 0.75: LED3.A 118.11,43.18 R25.1
N$11
  Bottom 3: C23.1 29.21,55.88 33.66,51.44 R29.2
N$12
  Bottom 0.75: D12.C C21.2 187.32,64.77 D11.C D14.C 191.13,69.22 R33.2 187.96,72.39 187.96,77.47 187.32,78.11 IC7.8
N$13
  Bottom 0.75: 194.31,17.14 196.22,15.24 199.39,15.24 200.66,16.51 R19.2 200.66,19.68 204.47,23.5 X3.3 | 194.31,17.14 R9.2 | IC4.7 192.41,15.24 194.31,17.14
N$14
  Bottom 0.75: R30.2 197.49,10.16 194.94,12.7 IC4.6 | R30.2 197.49,5.08 JP7.1 | R30.2 197.49,9.53 X3.2
N$15
  Bottom 0.75: IC4.4 181.61,10.16 R17.1 177.16,14.61 177.16,19.05 172.95,23.27 169.56,23.27 166.15,26.67 OK3.6 166.01,26.67
N$16
  Bottom 0.75: R18.2 170.18,40.01 167,43.18 OK1.3
N$17
  Bottom 0.75: IC4.1 182.88,19.68 180.34,22.23 R18.1
N$18
  Bottom 0.75: T1.E Q2.E 88.27,88.9 85.72,91.44 85.72,92.71 80.64,97.79 R11.1
N$19
  Bottom 0.75: R10.1 LED1.A
N$20
  Bottom 0.75: R14.1 149.22,15.88 152.4,12.7 OK2.3
N$21
  Bottom 0.75: OK3.3 151.76,26.67 R15.1
N$22
  Bottom 3: D4.C D3.A 54.61,24.54 56.72,22.43 F1.2 56.72,16.08 55.24,14.61 X6.3
N$23
  Bottom 0.75: J1.4 IC3.19
N$24
  Bottom 0.75: JP7.2 R19.1
N$25
  Bottom 0.75: IC6.6 R20.1 154.31,93.34 C19.2 147.96,87 IC5.2
N$26
  Bottom 0.75: IC8.1 207.01,39.37 210.19,36.2 210.19,33.02 208.28,31.11 201.29,31.11 R26.2 196.85,29.21 182.88,43.18 C22.+
N$27
  Bottom 0.75: IC5.6 IC5.7
N$28
  Bottom 0.75: IC7.2 IC7.1
N$29
  Bottom 0.75: C20.1 191.77,78.96 | IC7.7 C20.1 | IC6.2 175.74,95.89 177.39,97.53 192.41,97.53 194.94,94.99 194.94,81.28 193.04,79.38 C20.1
N$30
  Bottom 0.75: IC7.5 187.96,81.92 188.59,82.55 R22.2
N$31
  Bottom 0.75: R24.2 D15.A D13.A R21.1
N$32
  Bottom 0.75: R21.2 179.07,95.25 183.51,90.81 183.51,80.01 | 183.51,80.01 184.15,80.64 IC7.6 189.23,80.64 190.5,81.92 C20.2 | IC6.4 170.82,67.94 180.34,58.42 182.88,58.42 184.78,60.33 184.78,74.93 183.51,76.2 183.51,80.01
N$33
  Bottom 3: X1.2 X6.4 46.35,13.97 D1.A 52.93,34.29 64.55,34.29 D2.C
N$34
  Bottom 0.75: U1.2 U1.1
  Bottom 3: X2.2 51.44,85.72 49.59,83.89 U1.1
N$35
  Bottom 0.75: U1.3 U1.4
  Bottom 3: Q3.D 19.05,33.02 15.24,36.83 15.24,71.12 18.41,74.3 D9.A 21.59,82.55 R29.1 33.66,85.72 35.49,83.89 U1.4
N$36
  Bottom 0.75: J1.3 IC3.18
N$37
  Bottom 3: R27.1 46.35,60.96 C5.+ 46.35,57.15 D1.C D3.C | D9.C 45.72,69.22 R27.1 | X2.1 56.52,82.55 46.35,72.39 R27.1
N$38
  Bottom 0.75: U1.6 43.18,94.87 C9.1
N$39
  Bottom 0.75: IC1.6 88.33,64.77 | 88.33,64.77 IC1.7 | 88.33,64.77 86.36,64.77 85.72,64.14 85.72,61.59 88.9,58.42 93.69,58.42 95.25,56.86 R4.2
N$40
  Bottom 0.75: R4.1 95.25,48.9 93.34,50.8 C4.1 88.27,50.8 | IC1.2 81.28,64.14 80.64,63.5 80.64,58.42 88.27,50.8 | R6.2 88.27,50.8
N$41
  Bottom 0.75: IC1.3 80.64,65.41 R5.2 C3.1 R3.1
N$42
  Bottom 3: X1.1 34.92,20.12 F1.1
N$43  (via drill 1)
  Top 1: v180.34,19.05 v170.18,19.05
  Bottom 0.75: R17.2 R16.2 v170.18,19.05 168.28,19.05 167,17.78 OK2.8 | 168.27,33.66 167,34.92 163.83,34.92 161.93,36.83 161.93,46.35 163.19,47.62 168.91,47.62 | 168.27,29.84 168.27,33.66 | 168.27,29.84 168.27,26.67 170.18,24.77 173.99,24.77 179.71,19.05 v180.34,19.05 | OK3.8 166.37,31.75 168.27,29.84 | X3.4 208.91,28.57 212.09,31.75 212.09,40.01 207.65,44.45 IC8.3 201.93,44.45 198.75,47.62 168.91,47.62 | 168.27,33.66 168.27,39.37 167,40.64 OK1.2 | C17.+ 172.81,34.96 172.81,40.2 168.91,44.1 168.91,47.62 | 197.49,19.05 R30.1 | X3.4 206.38,27.8 | R30.1 195.58,20.32 C18.1 IC4.8 | R30.1 197.49,21.59 204.47,28.57 X3.4
N$44
  Bottom 0.75: J1.2 IC3.17
N$45
  Bottom 0.75: R7.1 92.71,97.79 90.81,95.89 T2.B
N$46
  Bottom 0.75: D6.C D5.A 69.85,15.24 62.23,15.24 60.33,13.34 X6.2
N$47
  Bottom 0.75: D16.A X3.5
N$48
  Bottom 0.75: 201.93,60.96 D12.A 200.6,61.59 198.82,63.37 198.82,93.47 200.6,95.25 D13.C X4.2
N$49
  Bottom 0.75: IC3.9 147.45,64.77 Q5.2 153.54,62.99 C14.1
N$50
  Bottom 0.75: IC3.10 148.72,67.31 Q5.1 153.54,67.82 C15.1
N$51
  Bottom 0.75: R26.1 D16.C
N$52
  Bottom 0.75: R32.1 157.48,83.82 153.67,80.01 R31.2 151.13,76.83 150.5,77.47 IC5.5
N$53
  Bottom 0.75: T2.C 88.27,92.71 90.81,90.17 Q2.B T1.B 90.81,78.74 R8.2
N$54
  Bottom 0.75: R33.1 178.44,74.3 R34.2 178.44,80.64 IC7.3
PWM
  Bottom 0.75: R7.2 97.16,90.17 102.23,95.25 R28.2 106.05,93.98 118.11,93.98 IC3.15
RESET  (via drill 1)
  Top 0.75: v113.03,58.42 v101.6,58.42
  Bottom 0.75: IC3.1 C13.+ 146.94,39.75 R12.1 144.78,36.83 144.78,22.86 142.24,20.32 132.08,20.32 106.05,46.35 106.05,55.88 103.5,58.42 v101.6,58.42 | v113.03,58.42 119.38,64.77 J1.5
RX
  Bottom 0.75: OK1.6 153.03,43.18 149.22,46.99 | 149.22,46.99 IC3.2 140.97,46.99 | R13.1 151.13,48.9 149.22,46.99
TX
  Bottom 0.75: IC3.3 140.34,49.53 139.06,48.26 R15.2
TX_EN
  Bottom 0.75: R14.2 137.16,27.3 137.16,49.78 139.45,52.07 IC3.4

### Text on the board
Bottom: Controlador de carga 5A - Rv. 2 | IFC - Luzerna / Clecio e Dionathan / Set. 2022